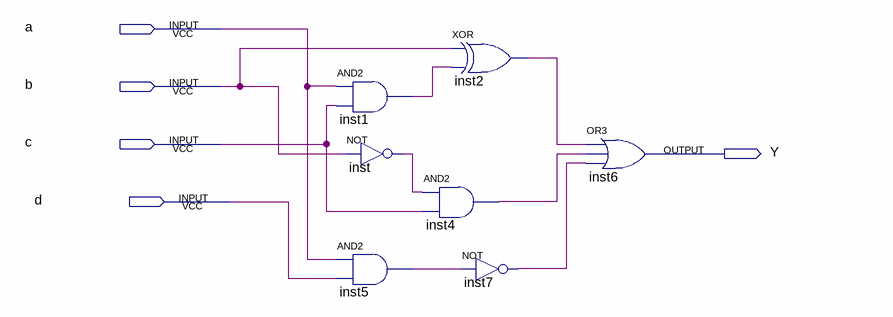
[diagram p0: schematic sheet]
// Quartus schematic Prac1.bdf as structural Verilog: 7 symbols, 5 pins
module Prac1 (
  input  a,
  input  b,
  input  c,
  input  d,
  output Y
);

  wire inst1_out, inst2_out, inst4_out, inst5_out, inst7_out, inst_out;

  and inst1 (inst1_out, a, c);
  not inst (inst_out, b);
  and inst5 (inst5_out, a, d);
  and inst4 (inst4_out, inst_out, c);
  xor inst2 (inst2_out, b, inst1_out);
  not inst7 (inst7_out, inst5_out);
  or inst6 (Y, inst2_out, inst4_out, inst7_out);
endmodule
